# EAGLE design nrf-v1 (EAGLE 8.1.1)
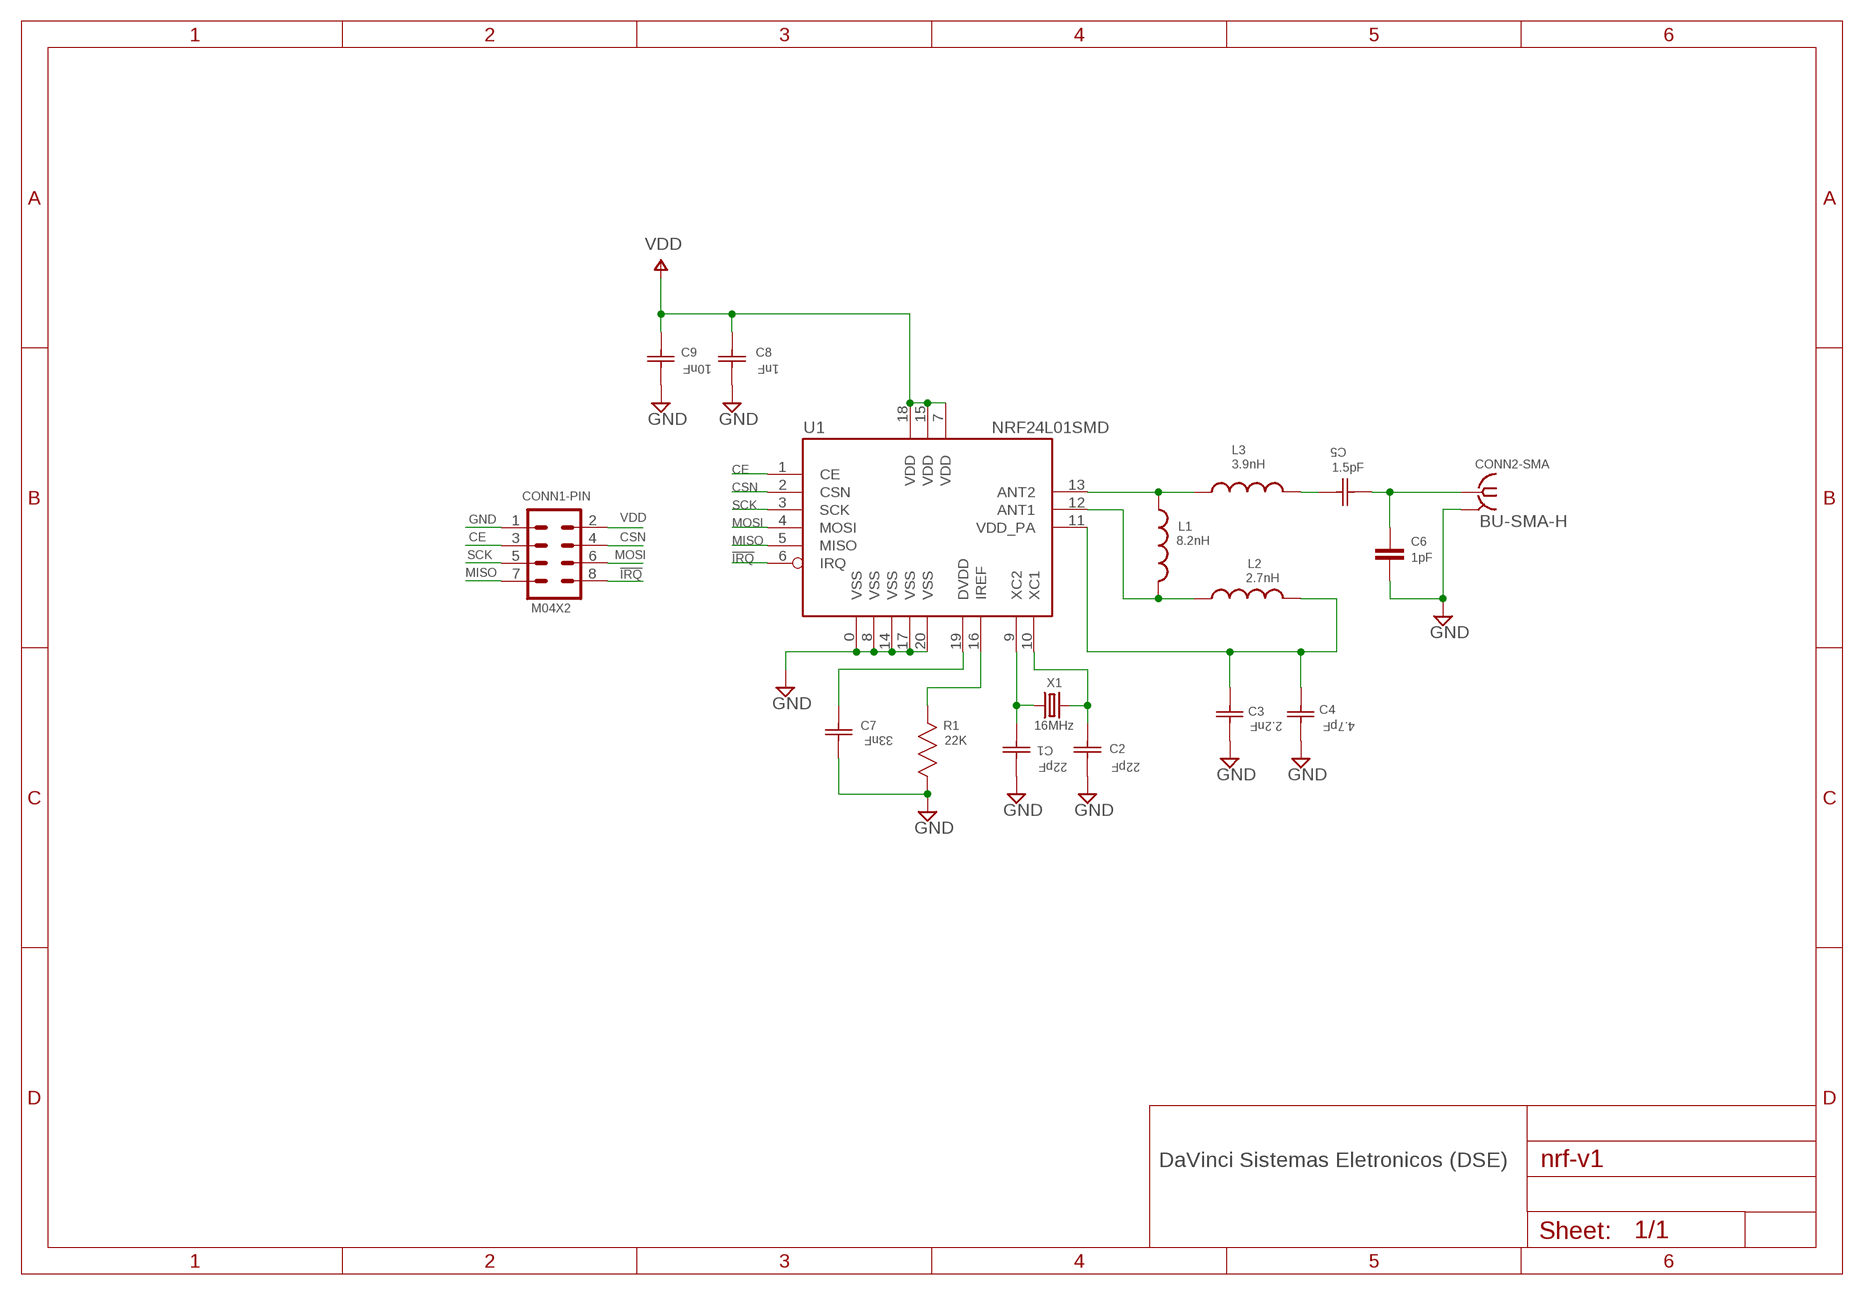
[diagram p0: schematic, sheet 1]

## Parts
C1  22pF  UQCL2A220JAT2A/500  [CAPC1005X60N]
C2  22pF  UQCL2A220JAT2A/500  [CAPC1005X60N]
C3  2.2nF  UQCL2A220JAT2A/500  [CAPC1005X60N]
C4  4.7pF  UQCL2A220JAT2A/500  [CAPC1005X60N]
C5  1.5pF  UQCL2A220JAT2A/500  [CAPC1005X60N]
C6  1pF  C-EU01005  [C01005]
C7  33nF  UQCL2A220JAT2A/500  [CAPC1005X60N]
C8  1nF  UQCL2A220JAT2A/500  [CAPC1005X60N]
C9  10nF  UQCL2A220JAT2A/500  [CAPC1005X60N]
CONN1-PIN  M04X2  [2X4]
CONN2-SMA  BU-SMA-H  [BU-SMA-H]
L1  8.2nH  INDUCTOR0402  [C0402]
L2  2.7nH  INDUCTOR0402  [C0402]
L3  3.9nH  INDUCTOR0402  [C0402]
R1  22K  TNPW040220K0BEED  [RESC1005X40N]
U1  NRF24L01SMD  [QFN20]
X1  16MHz  CRYSTALTXC-7A  [CRYSTAL-TXC-7A]

## Nets
!IRQ: CONN1-PIN.8 U1.6(IRQ)
CE: CONN1-PIN.3 U1.1(CE)
CSN: CONN1-PIN.4 U1.2(CSN)
GND: C1.2(C1) C2.2(C1) C3.2(C1) C4.2(C1) C6.2 C7.2(C1) C8.2(C1) C9.2(C1) CONN1-PIN.1 CONN2-SMA.2 CONN2-SMA.3 CONN2-SMA.4 CONN2-SMA.5 R1.1 U1.0(VSS) U1.8(VSS) U1.14(VSS) U1.17(VSS) U1.20(VSS)
MISO: CONN1-PIN.7 U1.5(MISO)
MOSI: CONN1-PIN.6 U1.4(MOSI)
N$1: C1.1(C2) U1.9(XC2) X1.P$1
N$2: C2.1(C2) U1.10(XC1) X1.P$2
N$3: L1.1 L3.1 U1.13(ANT2)
N$4: C5.1(C2) L3.2
N$5: C5.2(C1) C6.1 CONN2-SMA.1
N$6: L1.2 L2.1 U1.12(ANT1)
N$7: C3.1(C2) C4.1(C2) L2.2 U1.11(VDD_PA)
N$9: C7.1(C2) U1.19(DVDD)
N$10: R1.2 U1.16(IREF)
SCK: CONN1-PIN.5 U1.3(SCK)
VDD: C8.1(C2) C9.1(C2) CONN1-PIN.2 U1.7(VDD) U1.15(VDD) U1.18(VDD)

## Notes on the sheet
- DaVinci Sistemas Eletronicos (DSE)

## Library data of the parts
C1 C2 = AVX_By_element14_Batch_1:UQCL2A220JAT2A/500: Capacitor 0402; MPN: UQCL2A220JAT2A/500; OC_FARNELL: -; OC_NEWARK: 32T8809; SUPPLIER: AVX; TOLERANCE: ±5%; VOLTAGERATING: 200V
C3-C5 C7-C9 = AVX_By_element14_Batch_1:UQCL2A220JAT2A/500: Capacitor 0402; MPN: UQCL2A220JAT2A/500; OC_FARNELL: -; OC_NEWARK: 32T8809; SUPPLIER: AVX; TOLERANCE: ±5%; VALUE: 22pF; VOLTAGERATING: 200V
C6 = minhasLibs:C-EU: CAPACITOR, European symbol
CONN1-PIN = SparkFun-Connectors:M04X2: .1" header, two rows of four.
CONN2-SMA = minha-con-coax:BU-SMA-H: FEMALE SMA CONNECTOR Radiall; OC_FARNELL: unknown; OC_NEWARK: unknown
L1-L3 = SparkFun-Passives:INDUCTOR: Inductors Basic Inductor/Choke - 0603 and 1206. Footprints are not proven and vary greatly between part numbers. SRN6045- 33uH, 20% 1.4A SDR0403-560KL - 56uH, 10%, 500mA RMS/740mA peak
R1 = Vishay_By_element14_Batch_1:TNPW040220K0BEED: RESISTOR, 0402; MPN: TNPW040220K0BEED; OC_FARNELL: -; OC_NEWARK: 84R1878; SUPPLIER: Vishay Dale; TOLERANCE: ± 0.1 %; VALUE: 20K Ohms; WATTAGE: 0.063 W
U1 = SparkFun-RF:NRF24L01: 2.4GHz Low Power Transceiver This is the very popular, low cost, very low power RF transceiver from Nordic Semiconductor. Simple SPI interface. SKU: COM-00690
X1 = SparkFun-FreqCtrl:CRYSTAL: Various standard crystals. Proven footprints. Spark Fun Electronics SKU : COM-00534

## Board
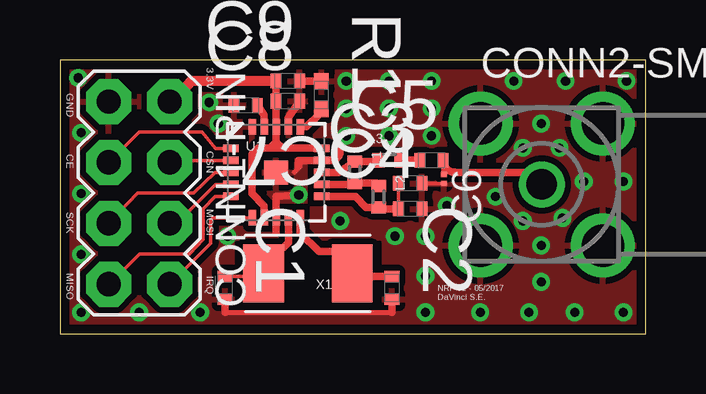
[diagram p1: board, top side]
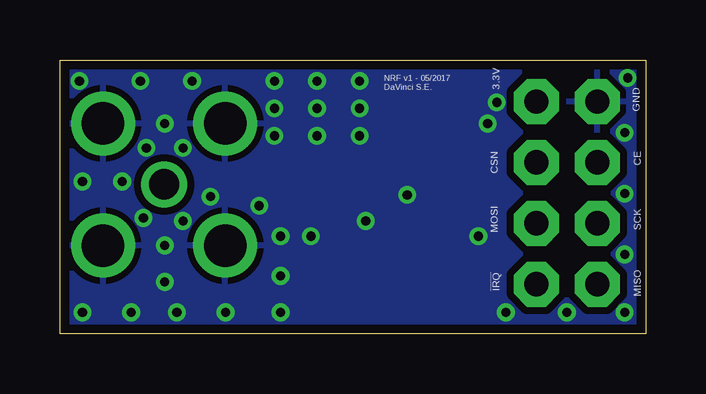
[diagram p2: board, bottom side, seen from below]

Size 24.43 x 11.42 mm. Coordinates in mm from the lower left corner, seen from the top.
Outline: 0,0 24.43,0 24.43,11.42 0,11.42 0,0
Copper layers (1*16): Top 0.0356mm / dielectric 1.5011mm / Bottom 0.0356mm
Design rules "oshpark-2layer": minimum track width 6mil, minimum drill 13mil, track to track 6mil, track to pad 6mil, pad to pad 6mil, via to via 6mil, smd to smd 6mil, copper to edge 15mil, drill to drill 6mil, minimum pad ring 7mil, minimum via ring 7mil, stop-mask expansion 2.5mil, vias tented up to drill 0mil, thermal gap 10mil

### Footprints (pad centres in the part's own frame; a part is rotated, then mirrored left to right if it is on the bottom)
CAPC1005X60N = smd 0.457 x 0.61: 1 -0.483,0; 2 0.483,0
C01005 = smd 0.2 x 0.25: 1 -0.163,0; 2 0.213,0
2X4 = drill 1.016 pad 1.88 octagon: 1 -3.81,-1.27; 2 -3.81,1.27; 3 -1.27,-1.27; 4 -1.27,1.27; 5 1.27,-1.27; 6 1.27,1.27; 7 3.81,-1.27; 8 3.81,1.27
BU-SMA-H = drill 1.27: 1 0,0 | drill 1.778: 2 -2.55,2.55; 3 2.55,2.55; 4 2.55,-2.55; 5 -2.55,-2.55
C0402 = smd 0.5 x 0.6: 1 -0.45,0; 2 0.45,0
RESC1005X40N = smd 0.66 x 0.61: 1 -0.584,0; 2 0.584,0
QFN20 = smd 1 x 1: 0 0,0 | smd 0.65 x 0.3: 1 -1.9,1; 2 -1.9,0.5; 3 -1.9,0; 4 -1.9,-0.5; 5 -1.9,-1; 11 1.9,-1; 12 1.9,-0.5; 13 1.9,0; 14 1.9,0.5; 15 1.9,1 | smd 0.3 x 0.65: 6 -1,-1.9; 7 -0.5,-1.9; 8 0,-1.9; 9 0.5,-1.9; 10 1,-1.9; 16 1,1.9; 17 0.5,1.9; 18 0,1.9; 19 -0.5,1.9; 20 -1,1.9
CRYSTAL-TXC-7A = smd 1.7 x 2.4: P$1 1.85,0; P$2 -1.85,0

### Placement (x,y rotation side)
C1  6.88,1.91 270 top
C2  13.84,1.91 270 top
C3  14.61,6.27 0 top
C4  14.61,5.21 0 top
C5  15.49,7.24 0 top
C6  16,6.48 270 top
C7  7.75,9.53 180 top
C8  9.5,9.7 0 top
C9  9.5,10.54 0 top
CONN1-PIN  3.3,5.87 270 top
CONN2-SMA  20.09,6.22 0 top
L1  12.29,6.73 270 top
L2  13.28,5.71 270 top
L3  13.74,7.24 0 top
R1  10.9,9.96 270 top
U1  9.02,6.73 0 top
X1  10.34,2.51 180 top

### Tracks (layer width: path | path; a pad name or v marks a point on that pad's centre or on a via)
!IRQ
  Top 0.152: 4.7,1.91 4.73,1.91 CONN1-PIN.8 5.53,3.02 5.54,3.02 5.54,3.03 5.55,3.03 5.63,3.12 6.27,3.76 6.27,3.82 6.28,3.82 6.27,3.94 6.27,4.75 6.36,4.83 U1.6
CE
  Top 0.152: U1.1 6.49,7.73 5.92,8.41 3.3,8.41 CONN1-PIN.3
CSN
  Top 0.152: U1.2 4.66,7.23 CONN1-PIN.4
GND  (via drill 0.38)
  Top 0.152: C1.2 6.88,1.4 | 15.09,6.22 C3.2 15.99,6.27 arc-90 C6.2
  Top 0.203: 10.91,7.21 U1.14 | 10.13,7.21 9.96,6.97 9.78,6.73 | 6.88,0.89 13.84,0.89
  Top 0.305: 6.88,0.89 C1.2 | 13.84,0.89 C2.2 | 8.02,8.53 U1.20 | 15.1,6.26 C3.2 | C8.2 9.52,8.98 U1.17 | C9.2 R1.1 | 9.96,6.97 9.96,7.23 U1.14 11.29,7.23 arc90 11.68,7.62 11.68,7.75 | 9.02,4.19 U1.8 9.02,5.71 v9.96,5.79
  other vias: 6.22,9.65 11.94,10.54 13.72,9.4 11.94,9.4 0.76,10.67 15.49,9.4 15.49,10.54 13.72,10.54 11.94,8.26 13.72,8.26 15.49,8.26 20.07,8.76 21.08,10.54 23.5,6.35 20.07,3.68 16.13,5.33 6.99,4.06 11.68,4.7 15.24,0.89 23.5,0.89 17.53,0.89 21.46,0.89 15.24,2.41 3.3,0.89 0.89,3.3 0.89,5.84 0.89,8.38 15.24,4.06 0.89,0.89 5.84,0.89 18.92,10.54 13.97,4.06 23.62,10.54 18.16,5.71 19.3,7.75 20.07,2.16 19.56,0.89 6.6,8.76 21.84,6.35 20.83,7.75 20.95,4.83 19.3,4.7
  pour Bottom (isolate 0.305): -0.13,11.56 24.38,11.68 24.51,0 0,0
  pour Top (isolate 0.254): 0,11.43 24.51,11.56 24.51,0 0,0
MISO
  Top 0.152: 7.1,5.71 6.48,5.71 5.97,5.21 5.97,3.94 5.41,3.33 3.33,3.33 2.06,2.06 CONN1-PIN.7
  Top 0.203: U1.5 7.1,5.71
MOSI
  Top 0.152: U1.4 6.49,6.23 4.86,4.6 CONN1-PIN.6
N$1
  Top 0.152: 8.44,2.39 C1.1
  Top 0.254: 8.44,2.39 X1.P$1 9.02,2.99 9.02,3.3 | U1.9
  Top 0.305: 9.02,3.3 9.53,3.81 U1.9
N$2
  Top 0.203: 12.42,2.39 X1.P$2
  Top 0.254: 11.56,3.43 11.56,2.99 X1.P$2
  Top 0.305: U1.10 10.02,4.21 10.79,3.43 11.56,3.43 | C2.1 12.42,2.39
N$3
  Top 0.152: 13.08,7.18 L3.1
  Top 0.305: 13.08,7.18 L1.1 11.62,6.73 U1.13
N$4
  Top 0.305: L3.2 C5.1
N$5
  Top 0.203: C6.1 16,7.21
  Top 0.254: 15.93,7.24 C5.2 16,7.21
  Top 0.305: CONN2-SMA.1 19.58,6.73 16.48,6.73 arc-90 C5.2
N$6
  Top 0.152: 12.02,6.23 L1.2 12.41,6.17
  Top 0.305: U1.12 12.02,6.23 | L1.2 13.17,6.28 arc-90 L2.1
N$7
  Top 0.152: 10.93,5.71 U1.11 | C3.1 C4.1 | L2.2 13.34,5.21
  Top 0.203: C4.1 14.06,5.01
  Top 0.305: 10.93,5.71 12.32,5.71 12.77,5.26 L2.2 | 13.34,5.21 C4.1
N$8
  cutout Top (isolate 1.27): 7.37,3.81 13.34,3.81 13.34,1.02 7.37,1.02
N$9
  Top 0.152: 8.26,9.53 C7.1 | U1.19
  Top 0.305: C7.1 8.52,9.11 U1.19
N$10
  Top 0.152: 10.82,9.17 R1.2
  Top 0.305: 10.82,9.17 10.28,8.63 U1.16
SCK
  Top 0.152: U1.3 6.48,6.73 5.56,5.87 3.25,5.87 CONN1-PIN.5
VDD
  Top 0.152: 9.02,8.89 U1.18 | 9.02,9.91 C8.1
  Top 0.254: 9.02,9.4 C8.1
  Top 0.305: 9.02,9.91 C9.1 | C8.1 9.02,8.89 | U1.15 10.9,7.75 9.27,7.75 | 9.02,7.75 9.27,7.75 | 9.02,7.75 8.76,7.75 | 8.76,7.75 8.26,7.75 8,7.49 8,5.84 8.52,5.33 U1.7 | U1.18 9.02,8 | 9.02,8 9.02,7.75 | 9.02,8 8.76,7.75 | 9.02,8 9.27,7.75
  Top 0.406: C9.1 5.46,10.54 4.73,9.68 CONN1-PIN.2

### Text on the board
tPlace: 3.3V | GND | CSN | CE | SCK | MOSI | MISO | !IRQ | NRF v1 - 05/2017 / DaVinci S.E.
bPlace: 3.3V | NRF v1 - 05/2017 / DaVinci S.E. | GND | CE | CSN | SCK | MOSI | MISO | !IRQ